# EAGLE design lp_dht11 (EAGLE 6.4)
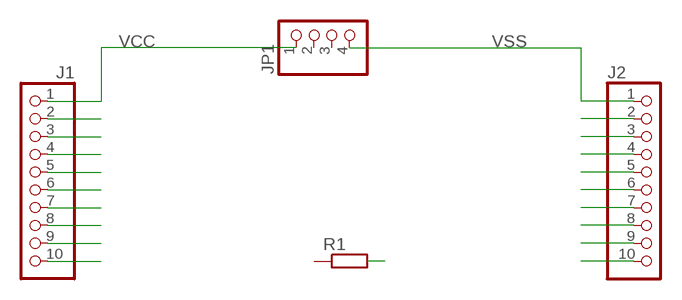
[diagram p0: schematic, sheet 1]

## Parts
J1  PH1X10OCT076  [PH1X10OCT76]
J2  PH1X10OCT076  [PH1X10OCT76]
JP1  PINHD-1X4  [1X04]
R1  R-EU_0207/10  [0207/10]

## Nets
N$1: R1.2
N$3: J2.5
N$21: J2.3
N$22: J2.6
N$23: J2.7
N$24: J2.8
N$25: J2.10
N$26: J2.9
N$99: J1.2
N$134: J1.10
N$136: J2.2
N$147: J1.3
N$262: J1.4
N$276: J1.5
N$346: J2.4
N$347: J1.9
N$348: J1.8
N$349: J1.7
N$350: J1.6
VCC: J1.1 JP1.1
VSS [Ground]: J2.1 JP1.4
Unconnected: JP1.2 JP1.3 R1.1

## Library data of the parts
J1 J2 = MY_CONN:PH1X10
JP1 = pinhead:PINHD-1X4: PIN HEADER
R1 = resistor:R-EU_: RESISTOR, European symbol

## Net classes
1 Ground: width 0.1 mm, drill 0.2 mm

## Board
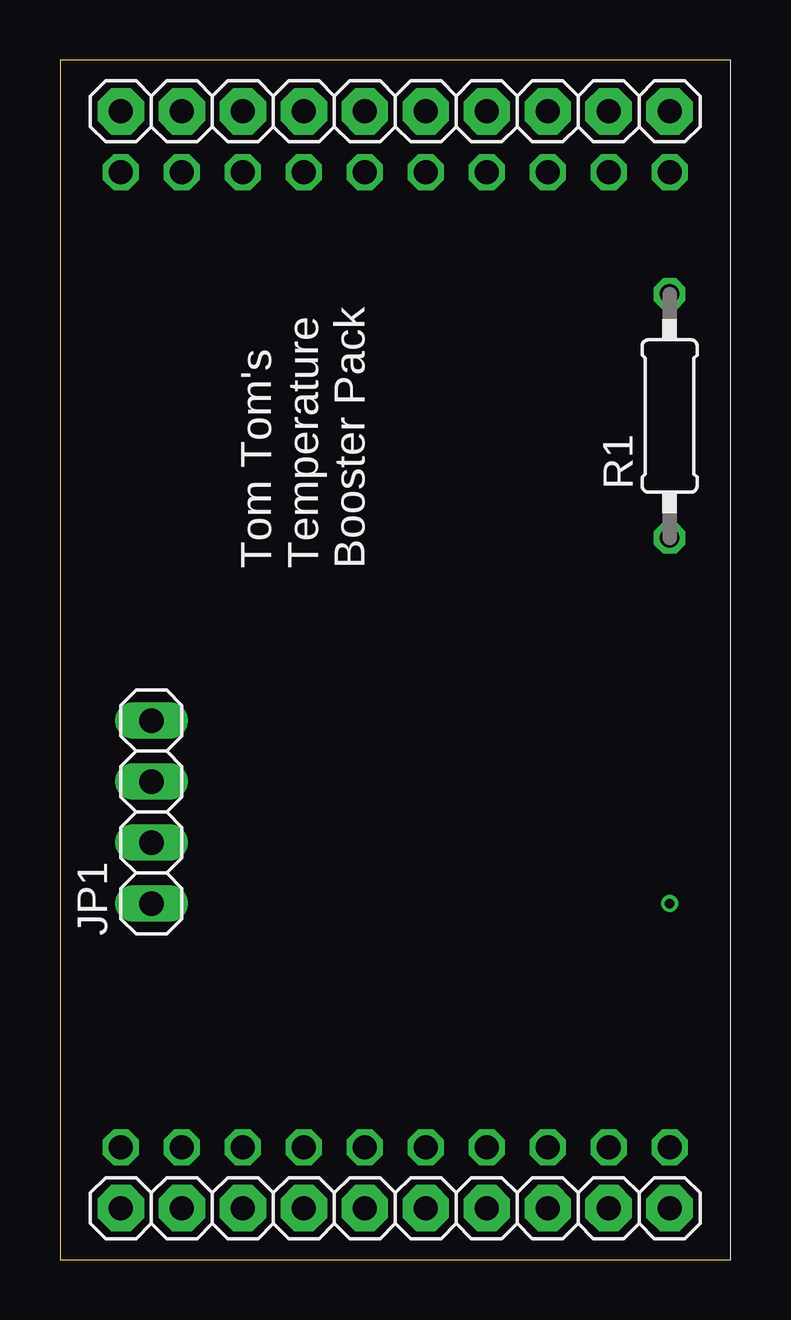
[diagram p1: board, top side]
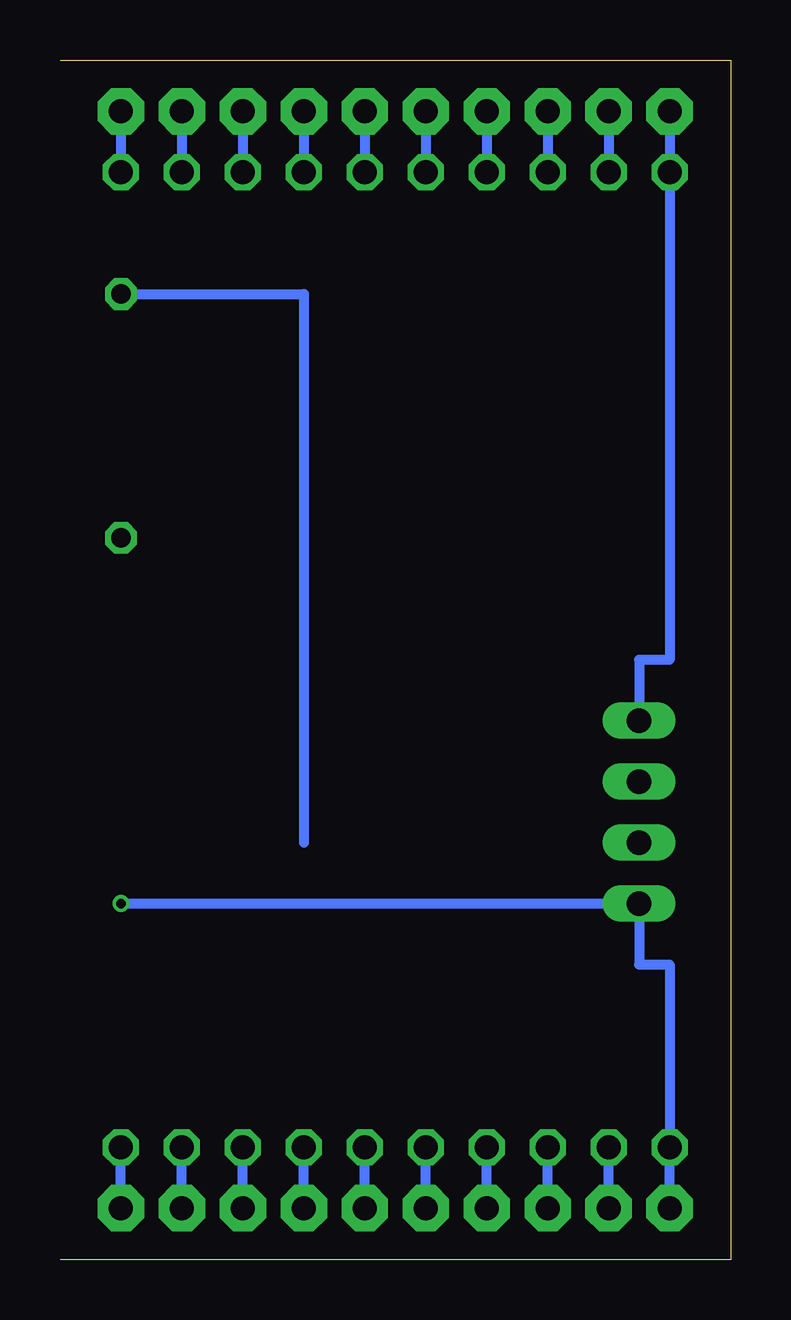
[diagram p2: board, bottom side, seen from below]

Size 27.94 x 50 mm. Coordinates in mm from the lower left corner, seen from the top.
Outline: 27.94,0 0,0 0,50 27.94,50
Copper layers (1*16): Top 0.035mm / dielectric 1.5mm / Bottom 0.035mm
Design rules "Fusion_eagle_rule_v1.1": minimum track width 6mil, minimum drill 12mil, track to track 6mil, track to pad 6mil, pad to pad 6mil, via to via 6mil, smd to smd 0mil, copper to edge 10mil, drill to drill 10mil, minimum pad ring 10mil, minimum via ring 6mil, stop-mask expansion 2mil, vias tented up to drill 100mil, thermal gap 10mil

### Footprints (pad centres in the part's own frame; a part is rotated, then mirrored left to right if it is on the bottom)
PH1X10OCT76 = drill 1 pad 1.93 octagon: 1 0,0; 2 2.54,0; 3 5.08,0; 4 7.62,0; 5 10.16,0; 6 12.7,0; 7 15.24,0; 8 17.78,0; 9 20.32,0; 10 22.86,0
1X04 = drill 1.016 long: 1 -3.81,0; 2 -1.27,0; 3 1.27,0; 4 3.81,0
0207/10 = drill 0.813 octagon: 1 -5.08,0; 2 5.08,0

### Placement (x,y rotation side)
J1  2.54,2.14 0 top
J2  2.54,47.86 0 top
JP1  3.81,18.65 90 top
R1  25.4,35.16 90 top

### Tracks (layer width: path | path; a pad name or v marks a point on that pad's centre or on a via)
N$1
  Bottom 0.406: R1.2 17.78,40.24 17.78,17.38
N$3  (via drill 1)
  Bottom 0.406: J2.5 v12.7,45.32
N$21  (via drill 1)
  Bottom 0.406: J2.3 v7.62,45.32
N$22  (via drill 1)
  Bottom 0.406: J2.6 v15.24,45.32
N$23  (via drill 1)
  Bottom 0.406: J2.7 v17.78,45.32
N$24  (via drill 1)
  Bottom 0.406: J2.8 v20.32,45.32
N$25  (via drill 1)
  Bottom 0.406: J2.10 v25.4,45.32
N$26  (via drill 1)
  Bottom 0.406: J2.9 v22.86,45.32
N$99  (via drill 1)
  Bottom 0.406: J1.2 v5.08,4.68
N$134  (via drill 1)
  Bottom 0.406: J1.10 v25.4,4.68
N$136  (via drill 1)
  Bottom 0.406: J2.2 v5.08,45.32
N$147  (via drill 1)
  Bottom 0.406: J1.3 v7.62,4.68
N$262  (via drill 1)
  Bottom 0.406: J1.4 v10.16,4.68
N$276  (via drill 1)
  Bottom 0.406: J1.5 v12.7,4.68
N$346  (via drill 1)
  Bottom 0.406: J2.4 v10.16,45.32
N$347  (via drill 1)
  Bottom 0.406: J1.9 v22.86,4.68
N$348  (via drill 1)
  Bottom 0.406: J1.8 v20.32,4.68
N$349  (via drill 1)
  Bottom 0.406: J1.7 v17.78,4.68
N$350  (via drill 1)
  Bottom 0.406: J1.6 v15.24,4.68
VCC  (via drill 0.4 pad 0.5, 1)
  Bottom 0.406: J1.1 v2.54,4.68 2.54,12.3 3.81,12.3 JP1.1 v25.4,14.84
VSS  (via drill 1 pad 0.3)
  Bottom 0.406: v2.54,45.32 J2.1 v2.54,45.32 | v2.54,45.32 2.54,25 3.81,25 JP1.4

### Text on the board
tNames: Tom Tom's / Temperature / Booster Pack